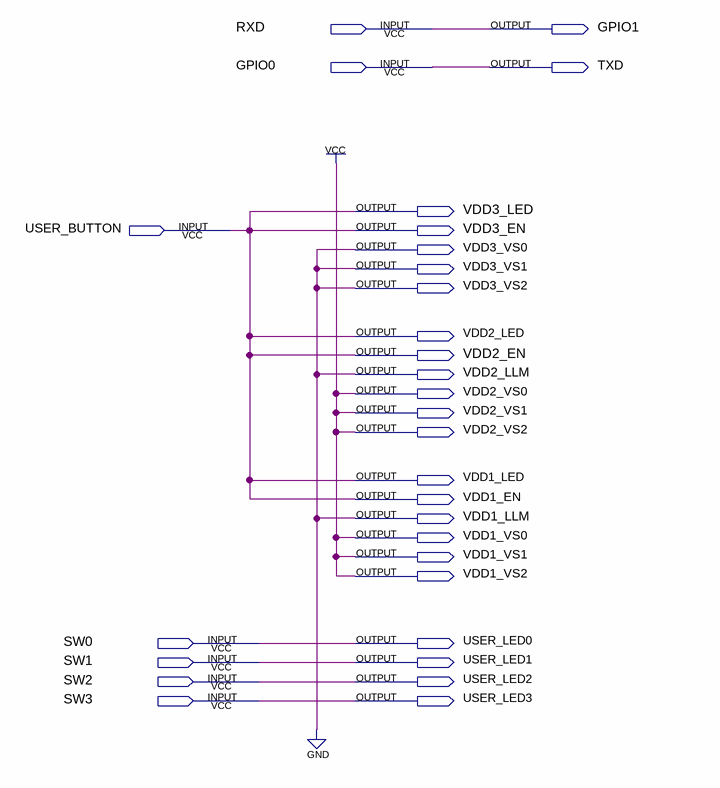
[diagram p0: schematic sheet]
// Quartus schematic tei0026_demo.bdf as structural Verilog: 0 symbols, 30 pins
module tei0026_demo (
  input  RXD,
  input  GPIO0,
  input  USER_BUTTON,
  input  SW0,
  input  SW1,
  input  SW2,
  input  SW3,
  output GPIO1,
  output TXD,
  output VDD3_LED,
  output VDD3_EN,
  output VDD3_VS0,
  output VDD3_VS1,
  output VDD3_VS2,
  output VDD2_LED,
  output VDD2_EN,
  output VDD2_LLM,
  output VDD2_VS0,
  output VDD2_VS1,
  output VDD2_VS2,
  output VDD1_LED,
  output VDD1_EN,
  output VDD1_LLM,
  output VDD1_VS0,
  output VDD1_VS1,
  output VDD1_VS2,
  output USER_LED0,
  output USER_LED1,
  output USER_LED2,
  output USER_LED3
);


  assign GPIO1 = RXD;
  assign TXD = GPIO0;
  assign USER_LED0 = SW0;
  assign USER_LED1 = SW1;
  assign USER_LED2 = SW2;
  assign USER_LED3 = SW3;
  assign VDD1_EN = USER_BUTTON;
  assign VDD1_LED = USER_BUTTON;
  assign VDD1_LLM = 1'b0;
  assign VDD1_VS0 = 1'b1;
  assign VDD1_VS1 = 1'b1;
  assign VDD1_VS2 = 1'b1;
  assign VDD2_EN = USER_BUTTON;
  assign VDD2_LED = USER_BUTTON;
  assign VDD2_LLM = 1'b0;
  assign VDD2_VS0 = 1'b1;
  assign VDD2_VS1 = 1'b1;
  assign VDD2_VS2 = 1'b1;
  assign VDD3_EN = USER_BUTTON;
  assign VDD3_LED = USER_BUTTON;
  assign VDD3_VS0 = 1'b0;
  assign VDD3_VS1 = 1'b0;
  assign VDD3_VS2 = 1'b0;
endmodule
